# Altium schematic sheet power-v5.SchDoc: CS - Power 5V
size Letter; CheckedBy: J. Brinton; CompanyName: Signal Laboratories, Inc.; DrawnBy: J. Brinton; Engineer: J. Brinton; Address1: 3479 Edison Way; Address2: Menlo Park CA 94025; Address3: +1 (877) 778-8435; Address4: siglabs.com; Revision: 3; SheetNumber: 42; SheetTotal: 47
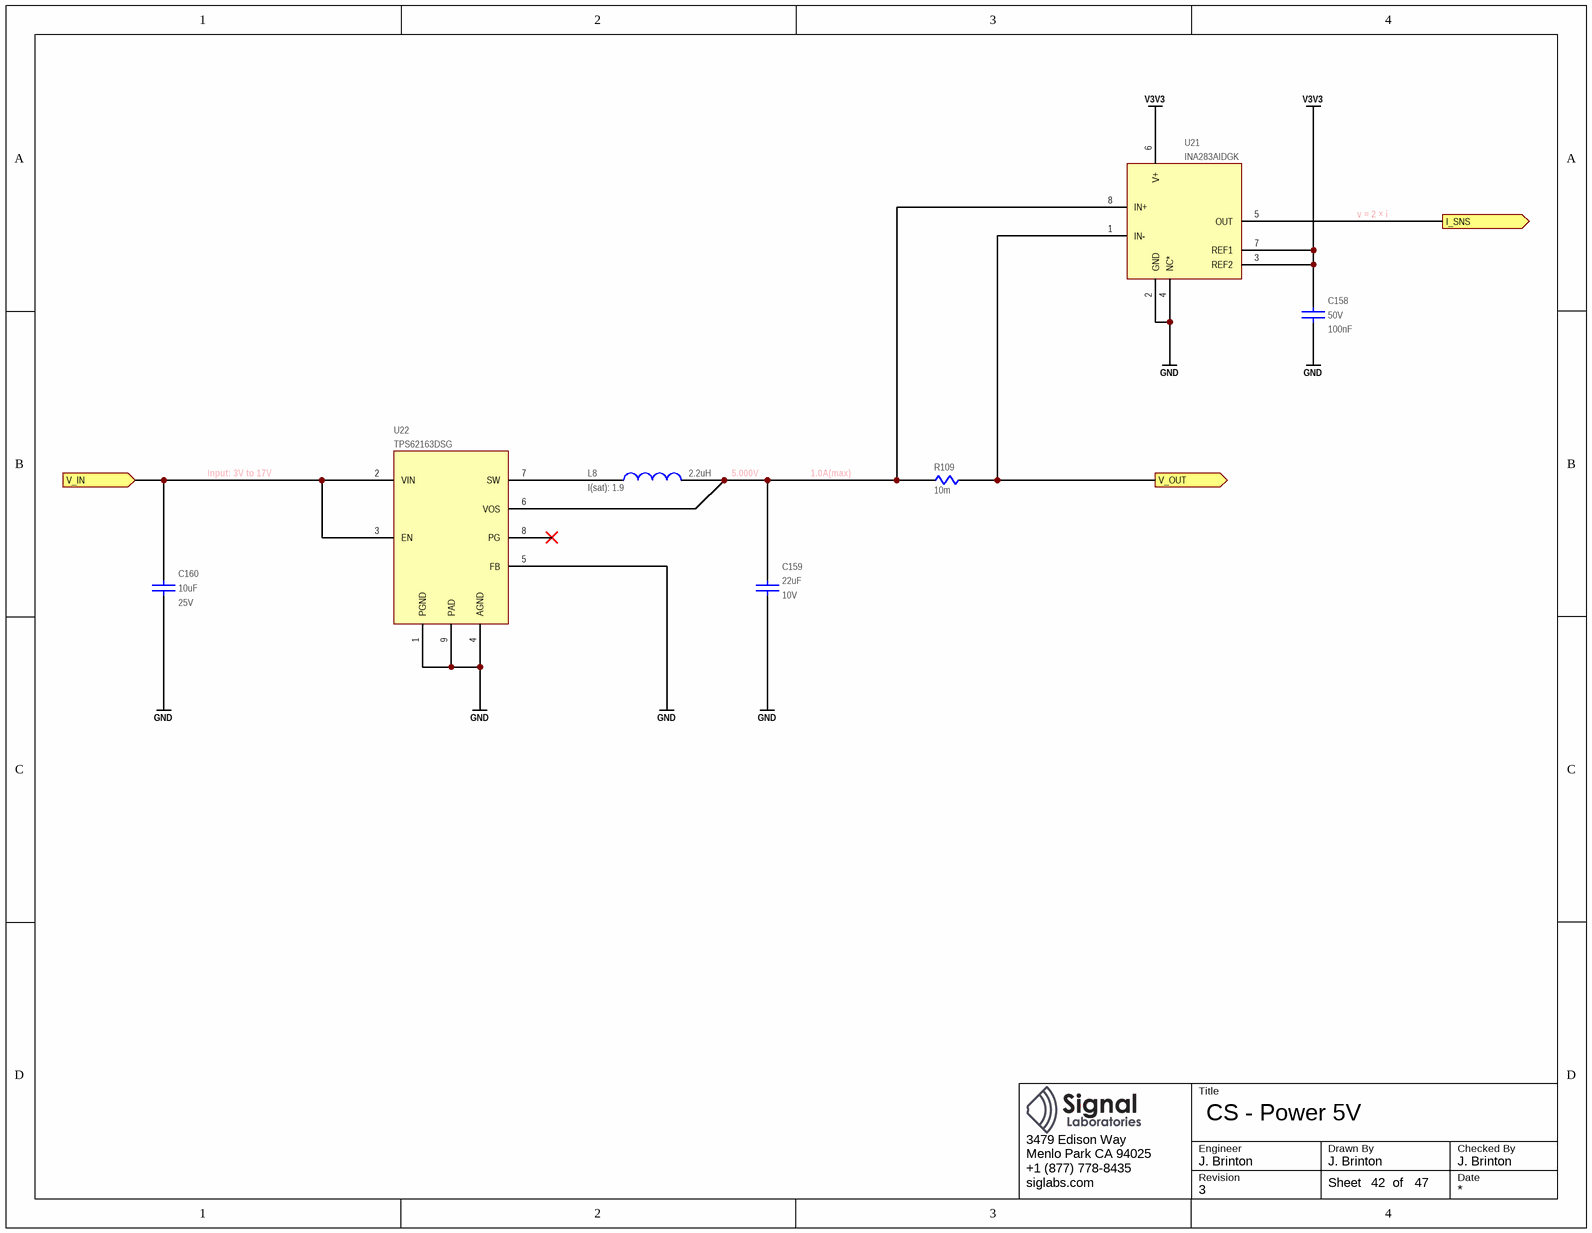
[diagram p0: power-v5.SchDoc]

## Parts
C158  value 100nF  Voltage: 50V  [CAPC100X50X55L25N]  (hidden comment: GCM155R71H104KE02)
C159  value 22uF  Voltage: 10V  [CAPC200X125X145L45N]  (hidden comment: C2012X7S1A226M125)
C160  value 10uF  Voltage: 25V  [CAPC200X125X145L45N]  (hidden comment: GRM21BC81E106KE51)
L8  value 2.2uH  I(sat): 1.9  [ASPI-3010FS]  (hidden comment: ASPI-0310FS-2R2M-T2)
R109  value 10m  [RESC3216X80L110N]  (hidden comment: CSR1206-0R01F1)
U21  INA283AIDGK  [S-PDSO-G8]
U22  TPS62163DSG  [DSG]

## Ports
I_SNS (out), V_IN (in), V_OUT (out)

## Nets
GND: C158.1 C159.1 C160.1 U21.2(GND) U21.4(NC*) U22.1(PGND) U22.4(AGND) U22.5(FB) U22.9(PAD)
V3V3: C158.2 U21.3(REF2) U21.6(V+) U21.7(REF1)
I_SNS: U21.5(OUT) ; port I_SNS
V_IN: C160.2 U22.2(VIN) U22.3(EN) ; port V_IN
V_OUT: R109.2 U21.1(IN-) ; port V_OUT
NetC159_2: C159.2 L8.2 R109.1 U21.8(IN+) U22.6(VOS)
NetL8_1: L8.1 U22.7(SW)

Not connected (* = marked no-connect by the designer): U22 8(PG)*

## Notes on the sheet
- v = 2 × i
- Input: 3V to 17V
- (near L8) 5.000V
- 1.0A(max)
- Title
- Engineer
- Revision
- Drawn By
- Checked By
- Date
- Sheet
- of

## Library data of the parts
C158 = CAP: Ceramic Capacitor 100nF ±10% 50V X7R 0402; Manufacturer: Murata; Tr: -55:125; Manufacturer P/N: GCM155R71H104KE02; Tolerance: ±10%; Package: 0402
C159 = CAP: Ceramic Capacitor 22uF ±20% 10V X7S 0805; Manufacturer: TDK; Tr: -55:125; Manufacturer P/N: C2012X7S1A226M125; Tolerance: ±20%; Package: 0805
C160 = CAP: Ceramic Capacitor 10uF ±10% 25V X6S 0805; Manufacturer: Murata; Tr: -55:105; Manufacturer P/N: GRM21BC81E106KE51; Tolerance: ±10%; Package: 0805
L8 = COIL: Wirewound Inductor 2.2uH +/-20% 1.9A SMD 2518; Manufacturer: Abracon; Manufacturer P/N: ASPI-0310FS-2R2M-T2
R109 = CSR1206-0R001F1: Current Sense Resistor 10mOhm +/-1% SMD 1206; Manufacturer: Riedon; Manufacturer P/N: CSR1206-0R01F1; Package: 1206
U21 = INA283AIDGK: Bidirectional Current Shunt Monitor; Manufacturer: Texas Instruments; Manufacturer P/N: INA283AIDGK
U22 = TPS62163DSG: 1A Step-Down Converter, 5V; Manufacturer: Texas Instruments; Manufacturer P/N: TPS62163DSG